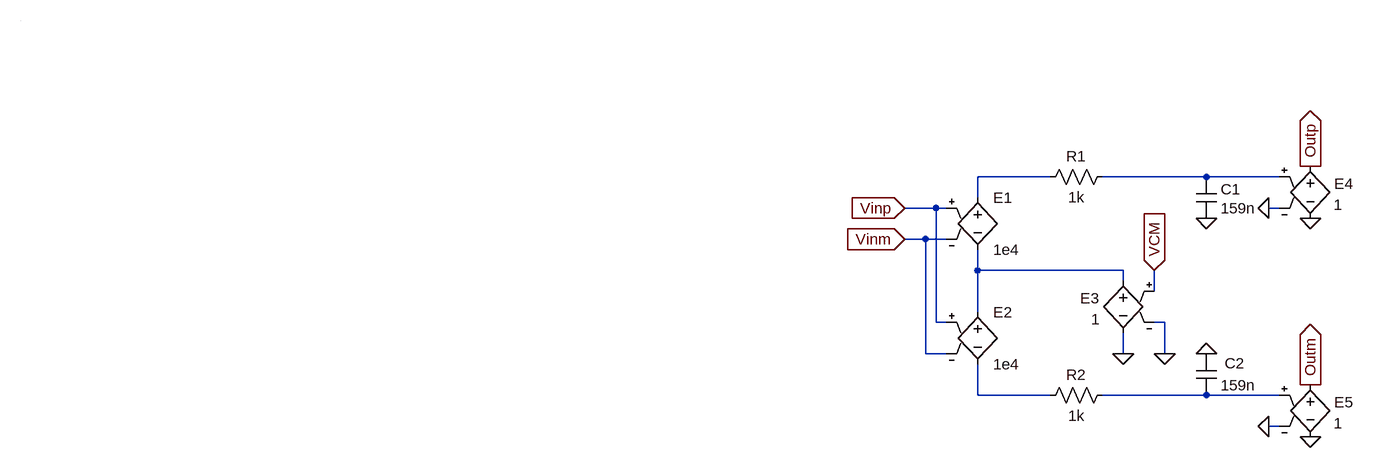
[diagram p0: schematic Gain_BW_diff_op_amp.asc]
Gain_BW_diff_op_amp.asc, the LTspice schematic file:
Version 4
SHEET 1 6300 692
WIRE 1392 336 1360 336
WIRE 1392 512 1392 336
WIRE 1408 288 1360 288
WIRE 1408 464 1408 288
WIRE 1424 288 1408 288
WIRE 1424 336 1392 336
WIRE 1424 464 1408 464
WIRE 1424 512 1392 512
WIRE 1472 272 1472 240
WIRE 1472 384 1472 352
WIRE 1472 448 1472 384
WIRE 1472 576 1472 528
WIRE 1584 240 1472 240
WIRE 1584 576 1472 576
WIRE 1696 384 1472 384
WIRE 1696 400 1696 384
WIRE 1696 512 1696 480
WIRE 1744 416 1744 384
WIRE 1760 464 1744 464
WIRE 1760 512 1760 464
WIRE 1824 240 1664 240
WIRE 1824 576 1664 576
WIRE 1936 240 1824 240
WIRE 1936 288 1920 288
WIRE 1936 576 1824 576
WIRE 1936 624 1920 624
WIRE 0 0 0 0
FLAG 1984 224 Outp
IOPIN 1984 224 Out
FLAG 1360 288 Vinp
IOPIN 1360 288 In
FLAG 1360 336 Vinm
IOPIN 1360 336 In
FLAG 1696 512 0
FLAG 1760 512 0
FLAG 1744 384 VCM
IOPIN 1744 384 In
FLAG 1824 304 0
FLAG 1824 512 0
FLAG 1984 560 Outm
IOPIN 1984 560 Out
FLAG 1920 288 0
FLAG 1984 304 0
FLAG 1920 624 0
FLAG 1984 640 0
SYMBOL e 1696 384 M0
WINDOW 0 37 43 Left 0
WINDOW 3 36 75 Left 0
SYMATTR InstName E3
SYMATTR Value 1
SYMBOL e 1472 256 R0
SYMATTR InstName E1
SYMATTR Value 1e4
SYMBOL e 1472 432 R0
SYMATTR InstName E2
SYMATTR Value 1e4
SYMBOL res 1680 224 R90
WINDOW 0 0 56 VBottom 0
WINDOW 3 32 56 VTop 0
SYMATTR InstName R1
SYMATTR Value 1k
SYMBOL res 1680 560 R90
WINDOW 0 0 56 VBottom 0
WINDOW 3 32 56 VTop 0
SYMATTR InstName R2
SYMATTR Value 1k
SYMBOL cap 1808 240 R0
WINDOW 0 38 19 Left 0
WINDOW 3 38 48 Left 0
SYMATTR InstName C1
SYMATTR Value 159n
SYMBOL cap 1808 512 R0
WINDOW 0 44 15 Left 0
WINDOW 3 38 49 Left 0
SYMATTR InstName C2
SYMATTR Value 159n
SYMBOL e 1984 208 R0
WINDOW 0 37 43 Left 0
WINDOW 3 36 75 Left 0
SYMATTR InstName E4
SYMATTR Value 1
SYMBOL e 1984 544 R0
WINDOW 0 37 43 Left 0
WINDOW 3 36 75 Left 0
SYMATTR InstName E5
SYMATTR Value 1

The netlist it stands for:
* Gain_BW_diff_op_amp.asc
E3 N002 0 VCM 0 1
E1 N001 N002 Vinp Vinm 1e4
E2 N002 N003 Vinp Vinm 1e4
R1 N004 N001 1k
R2 N005 N003 1k
C1 N004 0 159n
C2 0 N005 159n
E4 Outp 0 N004 0 1
E5 Outm 0 N005 0 1
.backanno
.end